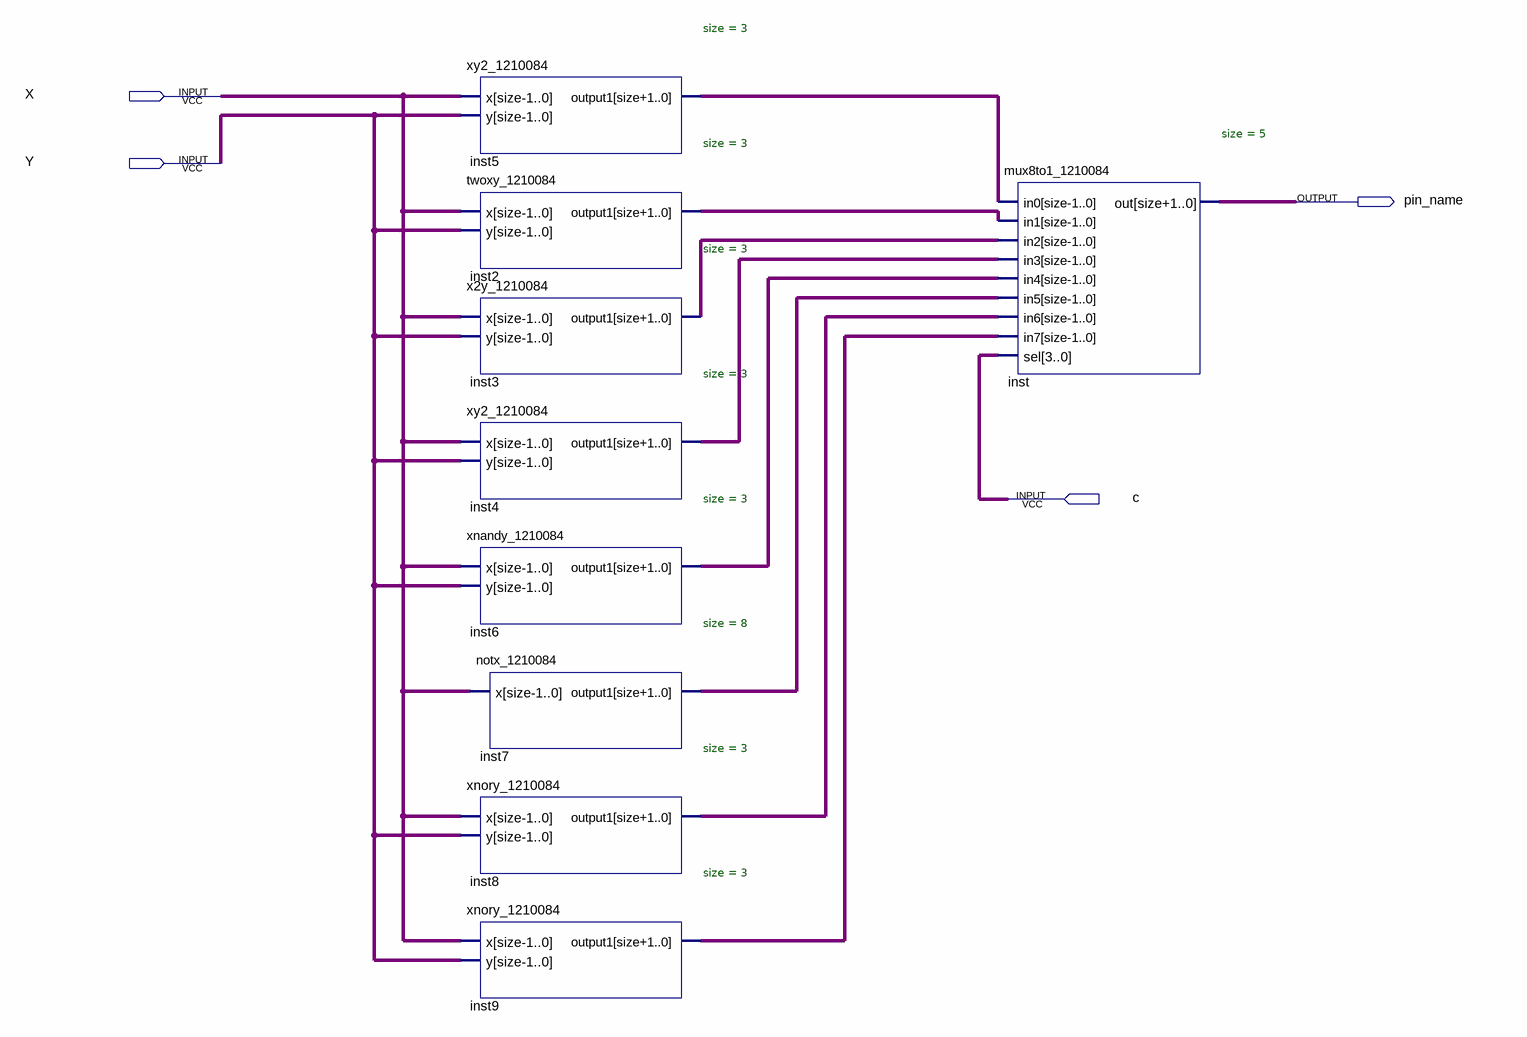
[diagram p0: schematic sheet]
// Quartus schematic Block1.bdf as structural Verilog: 9 symbols, 4 pins
module Block1 (
  input  X,
  input  Y,
  input  c,
  output pin_name
);

  wire [2:0] undriven_2;
  wire [3:0] undriven_3;
  wire [4:0] inst2_output1, inst3_output1, inst4_output1, inst5_output1, inst6_output1, inst8_output1,
       inst9_output1;
  wire [6:0] inst_out;
  wire [7:0] undriven;
  wire [9:0] inst7_output1;

  xy2_1210084 #(.size(3)) inst5 (.x(undriven), .y(undriven_2), .output1(inst5_output1));
  twoxy_1210084 #(.size(3)) inst2 (.x(undriven), .y(undriven_2), .output1(inst2_output1));
  x2y_1210084 #(.size(3)) inst3 (.x(undriven), .y(undriven_2), .output1(inst3_output1));
  xy2_1210084 #(.size(3)) inst4 (.x(undriven), .y(undriven_2), .output1(inst4_output1));
  xnandy_1210084 #(.size(3)) inst6 (.x(undriven), .y(undriven_2), .output1(inst6_output1));
  notx_1210084 #(.size(8)) inst7 (.x(undriven), .output1(inst7_output1));
  xnory_1210084 #(.size(3)) inst8 (.x(undriven), .y(undriven_2), .output1(inst8_output1));
  xnory_1210084 #(.size(3)) inst9 (.x(undriven), .y(undriven_2), .output1(inst9_output1));
  mux8to1_1210084 #(.size(5)) inst (
    .in0(inst5_output1), .in1(inst2_output1), .in2(inst3_output1), .in3(inst4_output1), .in4(inst6_output1),
    .in5(inst7_output1), .in6(inst8_output1), .in7(inst9_output1), .sel(undriven_3), .out(inst_out));
endmodule
